# Altium schematic sheet Rotary Encoder.SchDoc
size A; SheetNumber: 6; SheetTotal: 9
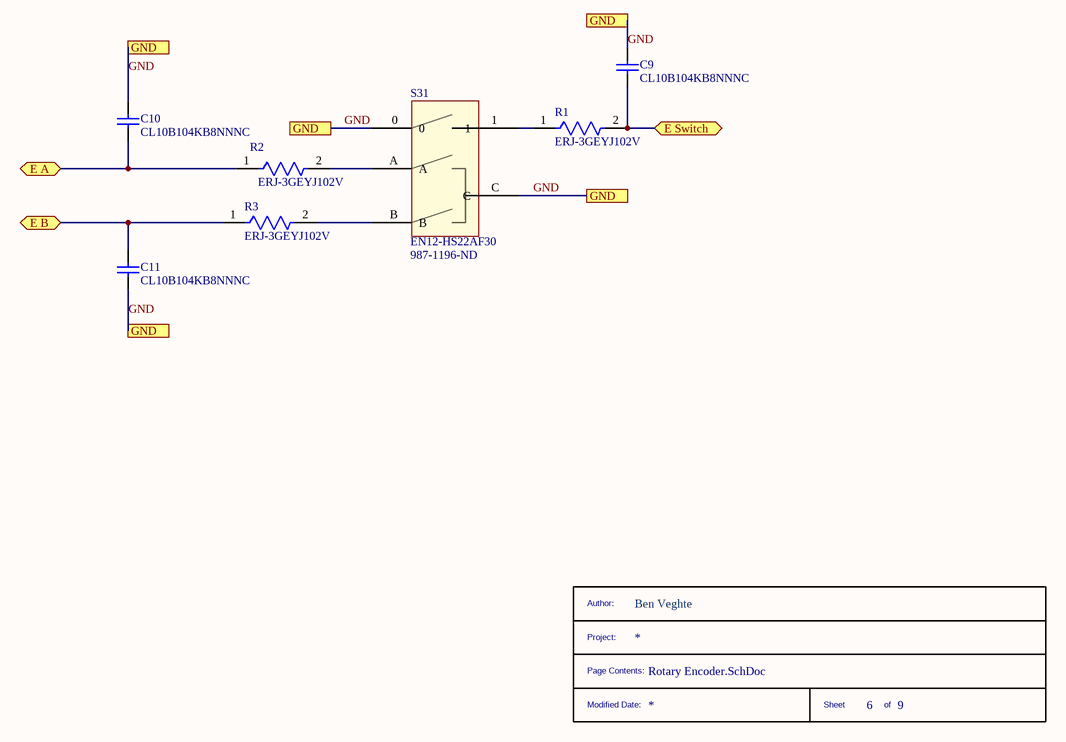
[diagram p0: Rotary Encoder.SchDoc]

## Parts
*  __TITLE_BLOCK__  (value not drawn)  (graphical)
C9  CL10B104KB8NNNC  [SAMS-C0603-2_M]
C10  CL10B104KB8NNNC  [SAMS-C0603-2_M]
C11  CL10B104KB8NNNC  [SAMS-C0603-2_M]
R1  ERJ-3GEYJ102V  [FP-ERJ3G-MFG]
R2  ERJ-3GEYJ102V  [FP-ERJ3G-MFG]
R3  ERJ-3GEYJ102V  [FP-ERJ3G-MFG]
S31  EN12-HS22AF30  Supplier Part Number 1: 987-1196-ND  [EN12-HS22AF30]

## Ports
E A (bidir), E B (bidir), E Switch (bidir), GND

## Nets
E A: C10.1 R2.1 ; port E A
E B: C11.2 R3.1 ; port E B
E Switch: C9.1 R1.2 ; port E Switch
GND: C9.2 C10.2 C11.1 S31.0 S31.C ; port GND
NetR1_1: R1.1 S31.1
NetR2_2: R2.2 S31.A
NetR3_2: R3.2 S31.B

## Notes on the sheet
- (in symbol __TITLE_BLOCK__) Author:; Ben Veghte; Project:; Page Contents:; Modified Date:; Sheet; of

## Library data of the parts
C9-C11 = CMP-2000-05332-1: Multi-layer Ceramic Capacitor, -55 to 125 degC, 2-Pin SMD (0603), RoHS, Tape and Reel; Manufacturer: Samsung Electro-Mechanics; Capacitance: 0.1µF; Rated Voltage: 50V; Dielectric: X7R; Tolerance (%): ±10%; Case Size/Dimension: 0603; Datasheet URL: https://datasheet.ciiva.com/29198/456651-da-01-en-vs-kondensator-0605-29198839.pdf; Manufacturer URL: http://www.samsungsem.com/global/index.jsp; Datasheet Version: Nov-10
R1-R3 = CMP-2000-00703-2: RES SMD 1K OHM 5% 1/10W 0603; Manufacturer: Panasonic; Resistance: 1000Ω; Voltage: 75 V; Power Rating: 0.1W; Temperature Coefficient: 200ppm/°C; Voltage Rating: 75V; Value: 1000Ω; Automotive Grade: Grade 0; Category: Res; Ipc Land Pattern Name: RESC16080X45; Mounting Type: surface mount; Manufacturer Part Number: ERJ-3GEYJ102V; Octopart: https://octopart.com/erj-3geyj102v-panasonic-55403670; Automotive: Yes; Temperature: -55°C to +155°C; ComponentLink2Description: Datasheet; Lead Free: Yes; Footprint Url: https://industrial.panasonic.com/cdbs/www-data/pdf/RDA0000/DMA0000COL17.pdf; Tolerance: 5%; Device Class L1: Passive Components; Height: 0.55mm; Temperature Range Low: -55°C; RoHS: TRUE; Package: ERJ3G; ComponentLink2URL: https://industrial.panasonic.com/cdbs/www-data/pdf/RDA0000/AOA0000C301.pdf; Temperature Range High: +155°C; Digikey Description: RES SMD 1K OHM 5% 1/10W 0603; Series: ERJ; Device Class L2: Resistors; Device Class L3: Chip SMD Resistors; Mouser Description: Res Thick Film 0603 1K Ohm 5% 1/10W ±200ppm/°C Molded SMD Punched Carrier T/R; Composition: Thick Film
S31 = EN12-HS22AF30: Rotary Encoder; Supplier 1: Digi-Key